# EAGLE design satcam_v3_mini (EAGLE 7.7.0)
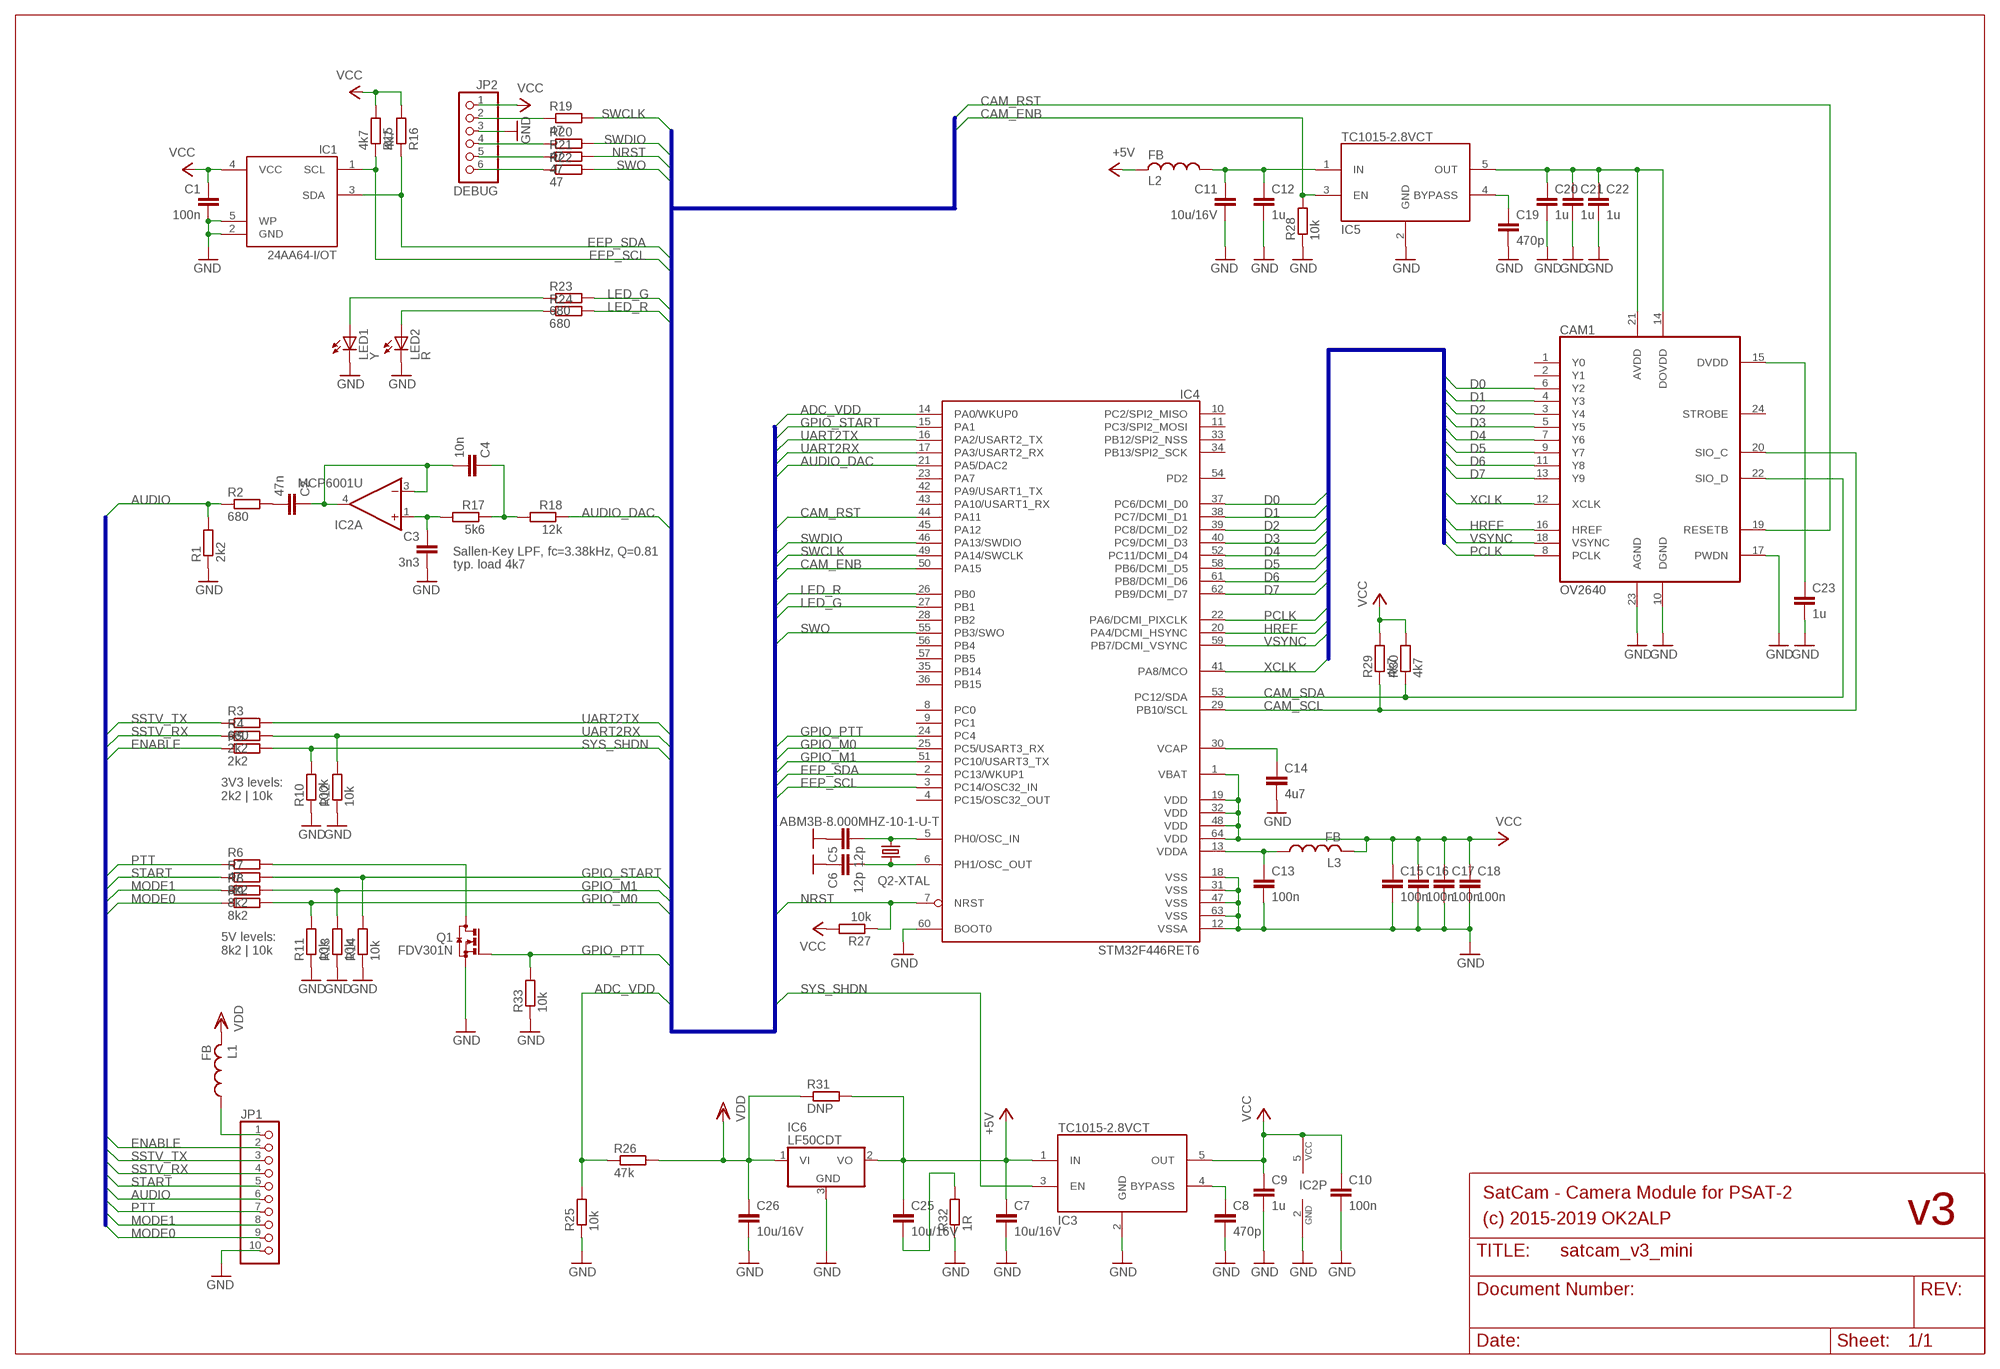
[diagram p0: schematic, sheet 1]

## Parts
C1  100n  C-EUC0603  [C0603]
C2  47n  C-EUC0603  [C0603]
C3  3n3  C-EUC0603  [C0603]
C4  10n  C-EUC0603  [C0603]
C5  12p  C-EUC0603  [C0603]
C6  12p  C-EUC0603  [C0603]
C7  10u/16V  C-EUC0805K  [C0805K]
C8  470p  C-EUC0603  [C0603]
C9  1u  C-EUC0603  [C0603]
C10  100n  C-EUC0603  [C0603]
C11  10u/16V  C-EUC0805K  [C0805K]
C12  1u  C-EUC0603  [C0603]
C13  100n  C-EUC0603  [C0603]
C14  4u7  C-EUC0603  [C0603]
C15  100n  C-EUC0603  [C0603]
C16  100n  C-EUC0603  [C0603]
C17  100n  C-EUC0603  [C0603]
C18  100n  C-EUC0603  [C0603]
C19  470p  C-EUC0603  [C0603]
C20  1u  C-EUC0603  [C0603]
C21  1u  C-EUC0402  [C0402]
C22  1u  C-EUC0402  [C0402]
C23  1u  C-EUC0402  [C0402]
C25  10u/16V  C-EUC0805K  [C0805K]
C26  10u/16V  C-EUC0805K  [C0805K]
CAM1  OV2640  [52745-2490]
IC1  24AA64-I/OT  [SOT23-5]
IC2  MCP6001U  [SOT23-5]
IC3  TC1015-2.8VCT  TC1015  [SOT23-5]
IC4  STM32F446RET6  [TQFP64-10X10]
IC5  TC1015-2.8VCT  TC1015  [SOT23-5]
IC6  LF50CDT  7805DT  [TO252]
JP1  PINHD-1X10  [1X10]
JP2  DEBUG  PINHD-1X6  [1X06]
L1  FB  [R0603]
L2  FB  [R0603]
L3  FB  [R0603]
LED1  Y  LEDCHIP-LED0603  [CHIP-LED0603]
LED2  R  LEDCHIP-LED0603  [CHIP-LED0603]
Q1  FDV301N  BSS123  [SOT23]
Q2  ABM3B-8.000MHZ-10-1-U-T  C3E_CRYSTAL-5032  [CER5032]
R1  2k2  R-EU_R0603  [R0603]
R2  680  R-EU_R0603  [R0603]
R3  680  R-EU_R0603  [R0603]
R4  2k2  R-EU_R0603  [R0603]
R5  2k2  R-EU_R0603  [R0603]
R6  47  R-EU_R0603  [R0603]
R7  8k2  R-EU_R0603  [R0603]
R8  8k2  R-EU_R0603  [R0603]
R9  8k2  R-EU_R0603  [R0603]
R10  100k  R-EU_R0603  [R0603]
R11  10k  R-EU_R0603  [R0603]
R12  10k  R-EU_R0603  [R0603]
R13  10k  R-EU_R0603  [R0603]
R14  10k  R-EU_R0603  [R0603]
R15  4k7  R-EU_R0603  [R0603]
R16  4k7  R-EU_R0603  [R0603]
R17  5k6  R-EU_R0603  [R0603]
R18  12k  R-EU_R0603  [R0603]
R19  47  R-EU_R0603  [R0603]
R20  47  R-EU_R0603  [R0603]
R21  47  R-EU_R0603  [R0603]
R22  47  R-EU_R0603  [R0603]
R23  680  R-EU_R0603  [R0603]
R24  680  R-EU_R0603  [R0603]
R25  10k  R-EU_R0603  [R0603]
R26  47k  R-EU_R0603  [R0603]
R27  10k  R-EU_R0603  [R0603]
R28  10k  R-EU_R0603  [R0603]
R29  4k7  R-EU_R0603  [R0603]
R30  4k7  R-EU_R0603  [R0603]
R31  DNP  R-EU_R0603  [R0603]
R32  1R  R-EU_R0603  [R0603]
R33  10k  R-EU_R0603  [R0603]

## Nets
+5V: C7.1 C25.1 IC3.1(IN) IC6.2(VO) L2.2 R31.2
ADC_VDD: IC4.14(PA0/WKUP0) R25.2 R26.1
AUDIO: JP1.6 R1.2 R2.1
AUDIO_DAC: IC4.21(PA5/DAC2) R18.1
CAM_ENB: IC4.50(PA15) IC5.3(EN) R28.2
CAM_RST: CAM1.19(RESETB) IC4.44(PA11)
CAM_SCL: CAM1.20(SIO_C) IC4.29(PB10/SCL) R29.1
CAM_SDA: CAM1.22(SIO_D) IC4.53(PC12/SDA) R30.1
D0: CAM1.6(Y2) IC4.37(PC6/DCMI_D0)
D1: CAM1.4(Y3) IC4.38(PC7/DCMI_D1)
D2: CAM1.3(Y4) IC4.39(PC8/DCMI_D2)
D3: CAM1.5(Y5) IC4.40(PC9/DCMI_D3)
D4: CAM1.7(Y6) IC4.52(PC11/DCMI_D4)
D5: CAM1.9(Y7) IC4.58(PB6/DCMI_D5)
D6: CAM1.11(Y8) IC4.61(PB8/DCMI_D6)
D7: CAM1.13(Y9) IC4.62(PB9/DCMI_D7)
EEP_SCL: IC1.1(SCL) IC4.3(PC14/OSC32_IN) R15.1
EEP_SDA: IC1.3(SDA) IC4.2(PC13/WKUP1) R16.1
ENABLE: JP1.2 R5.1
GND: C1.2 C3.2 C5.1 C6.1 C7.2 C8.2 C9.2 C10.2 C11.2 C12.2 C13.2 C14.2 C15.2 C16.2 C17.2 C18.2 C19.2 C20.2 C21.2 C22.2 C23.2 C26.2 CAM1.10(DGND) CAM1.17(PWDN) CAM1.23(AGND) IC1.2(GND) IC1.5(WP) IC2.2(P:GND) IC3.2(GND) IC4.12(VSSA) IC4.18(VSS) IC4.31(VSS) IC4.47(VSS) IC4.60(BOOT0) IC4.63(VSS) IC5.2(GND) IC6.3(GND) JP1.10 JP2.3 LED1.C LED2.C Q1.2(S) Q2.2(-GND1:GND) Q2.4(-GND2:GND) R1.1 R10.1 R11.1 R12.1 R13.1 R14.1 R25.1 R28.1 R32.1 R33.1
GPIO_M0: IC4.25(PC5/USART3_RX) R9.2 R11.2
GPIO_M1: IC4.51(PC10/USART3_TX) R8.2 R13.2
GPIO_PTT: IC4.24(PC4) Q1.1(G) R33.2
GPIO_START: IC4.15(PA1) R7.2 R14.2
HREF: CAM1.16(HREF) IC4.20(PA4/DCMI_HSYNC)
LED_G: IC4.27(PB1) R23.2
LED_R: IC4.26(PB0) R24.2
MODE0: JP1.9 R9.1
MODE1: JP1.8 R8.1
N$1: C11.1 C12.1 IC5.1(IN) L2.1
N$2: C23.1 CAM1.15(DVDD)
N$3: Q1.3(D) R6.2
N$4: C19.1 IC5.4(BYPASS)
N$6: C25.2 R32.2
N$7: JP1.1 L1.1
N$9: C8.1 IC3.4(BYPASS)
N$10: LED2.A R24.1
N$11: LED1.A R23.1
N$12: C14.1 IC4.30(VCAP)
N$18: C13.1 IC4.13(VDDA) L3.1
N$26: C6.2 IC4.6(PH1/OSC_OUT) Q2.3
N$27: C5.2 IC4.5(PH0/OSC_IN) Q2.1
N$129: C2.1 C4.2 IC2.3(A:-IN) IC2.4(A:OUT)
N$130: C4.1 R17.1 R18.2
N$131: C3.1 IC2.1(A:+IN) R17.2
N$137: JP2.4 R20.1
N$138: JP2.2 R19.1
N$143: JP2.5 R21.1
N$145: JP2.6 R22.1
N$152: C2.2 R2.2
NRST: IC4.7(NRST) R21.2 R27.1
PCLK: CAM1.8(PCLK) IC4.22(PA6/DCMI_PIXCLK)
PTT: JP1.7 R6.1
SSTV_RX: JP1.4 R4.1
SSTV_TX: JP1.3 R3.1
START: JP1.5 R7.1
SWCLK: IC4.49(PA14/SWCLK) R19.2
SWDIO: IC4.46(PA13/SWDIO) R20.2
SWO: IC4.55(PB3/SWO) R22.2
SYS_SHDN: IC3.3(EN) R5.2 R10.2
UART2RX: IC4.17(PA3/USART2_RX) R4.2 R12.2
UART2TX: IC4.16(PA2/USART2_TX) R3.2
VCAM: C20.1 C21.1 C22.1 CAM1.14(DOVDD) CAM1.21(AVDD) IC5.5(OUT)
VCC: C1.1 C9.1 C10.1 C15.1 C16.1 C17.1 C18.1 IC1.4(VCC) IC2.5(P:VCC) IC3.5(OUT) IC4.1(VBAT) IC4.19(VDD) IC4.32(VDD) IC4.48(VDD) IC4.64(VDD) JP2.1 L3.2 R15.2 R16.2 R27.2 R29.2 R30.2
VDD: C26.1 IC6.1(VI) L1.2 R26.2 R31.1
VSYNC: CAM1.18(VSYNC) IC4.59(PB7/DCMI_VSYNC)
XCLK: CAM1.12(XCLK) IC4.41(PA8/MCO)
Unconnected: CAM1.1(Y0) CAM1.2(Y1) CAM1.24(STROBE) IC4.4(PC15/OSC32_OUT) IC4.8(PC0) IC4.9(PC1) IC4.10(PC2/SPI2_MISO) IC4.11(PC3/SPI2_MOSI) IC4.23(PA7) IC4.28(PB2) IC4.33(PB12/SPI2_NSS) IC4.34(PB13/SPI2_SCK) IC4.35(PB14) IC4.36(PB15) IC4.42(PA9/USART1_TX) IC4.43(PA10/USART1_RX) IC4.45(PA12) IC4.54(PD2) IC4.56(PB4) IC4.57(PB5)

## Buses
D[0..7],PCLK,XCLK,HREF,VSYNC
GPIO_START,GPIO_PTT,GPIO_M0,GPIO_M1,ADC_VDD,AUDIO_DAC,UART2TX,UART2RX,CAM_RST,CAM_ENB,SWDIO,SWCLK,SWO,NRST,LED_R,LED_G,SYS_SHDN,EEP_SDA,EEP_SCL
SSTV_RX,SSTV_TX,ENABLE,START,AUDIO,PTT,MODE0,MODE1

## Notes on the sheet
- Sallen-Key LPF, fc=3.38kHz, Q=0.81
- typ. load 4k7
- 3V3 levels:
  2k2 | 10k
- 5V levels:
  8k2 | 10k
- SatCam - Camera Module for PSAT-2
- (c) 2015-2019 OK2ALP | v3

## Library data of the parts
C1-C23 C25 C26 = rcl:C-EU: CAPACITOR, European symbol
CAM1 = satcam:OV2640
IC1 = satcam:24AA64
IC2 = satcam:MCP6001U
IC3 IC5 = satcam:TC1015
IC4 = satcam:STM32F446RET6
IC6 = linear:78*: Positive VOLTAGE REGULATOR Source: http://cache.national.com/ds/LM/LM78L05.pdf http://www.fairchildsemi.com/ds/LM/LM7805.pdf
JP1 = pinhead:PINHD-1X10: PIN HEADER
JP2 = pinhead:PINHD-1X6: PIN HEADER
L1-L3 = satcam:FB
LED1 LED2 = led:LED: LED OSRAM: - CHIPLED LG R971, LG N971, LY N971, LG Q971, LY Q971, LO R971, LY R971 LH N974, LH R974 LS Q976, LO Q976, LY Q976 LO Q996 - Hyper CHIPLED LW Q18S LB Q993, LB Q99A, LB R99A - SideLED LS A670, LO A670, LY A670, LG A670, LP A670 LB A673, LV A673, LT A673, LW A673 LH A674 LY A675 LS A676, LA A676, LO A676, LY A676, LW A676 LS A679, LY A679, LG A679 - Hyper Micro SIDELED® LS Y876, LA Y876, LO Y876, LY Y876 LT Y87S - SmartLED LW L88C, LW L88S LB L89C, LB L89S, LG L890 LS L89K, LO L89K, LY L89K LS L896, LA L896, LO L896, LY L896 - TOPLED LS T670, LO T670, LY T670, LG T670, LP T670 LSG T670, LSP T670, LSY T670, LOP T670, LYG T670 LG T671, LOG T671, LSG T671 LB T673, LV T673, LT T673, LW T673 LH T674 LS T676, LA T676, LO T676, LY T676, LB T676, LH T676, LSB T676, LW T676 LB T67C, LV T67C, LT T67C, LS T67K, LO T67K, LY T67K, LW E67C LS E67B, LA E67B, LO E67B, LY E67B, LB E67C, LV E67C, LT E67C LW T67C LS T679, LY T679, LG T679 LS T770, LO T770, LY T770, LG T770, LP T770 LB T773, LV T773, LT T773, LW T773 LH T774 LS E675, LA E675, LY E675, LS T675 LS T776, LA T776, LO T776, LY T776, LB T776 LHGB T686 LT T68C, LB T68C - Hyper Mini TOPLED® LB M676 - Mini TOPLED Santana® LG M470 LS M47K, LO M47K, LY M47K Source: http://www.osram.convergy.de LUXEON: - LUMILED® LXK2-PW12-R00, LXK2-PW12-S00, LXK2-PW14-U00, LXK2-PW14-V00 LXK2-PM12-R00, LXK2-PM12-S00, LXK2-PM14-U00 LXK2-PE12-Q00, LXK2-PE12-R00, LXK2-PE12-S00, LXK2-PE14-T00, LXK2-PE14-U00 LXK2-PB12-K00, LXK2-PB12-L00, LXK2-PB12-M00, LXK2-PB14-N00, LXK2-PB14-P00, LXK2-PB14-Q00 LXK2-PR12-L00, LXK2-PR12-M00, LXK2-PR14-Q00, LXK2-PR14-R00 LXK2-PD12-Q00, LXK2-PD12-R00, LXK2-PD12-S00 LXK2-PH12-R00, LXK2-PH12-S00 LXK2-PL12-P00, LXK2-PL12-Q00, LXK2-PL12-R00 Source: www.luxeon.com KINGBRIGHT: KA-3528ASYC Source: www.kingbright.com
Q1 = transistor-small-signal:BSS123: N-CHANNEL MOS FET
Q2 = satcam:C3E_CRYSTAL
R1-R33 = rcl:R-EU_: RESISTOR, European symbol

## Board
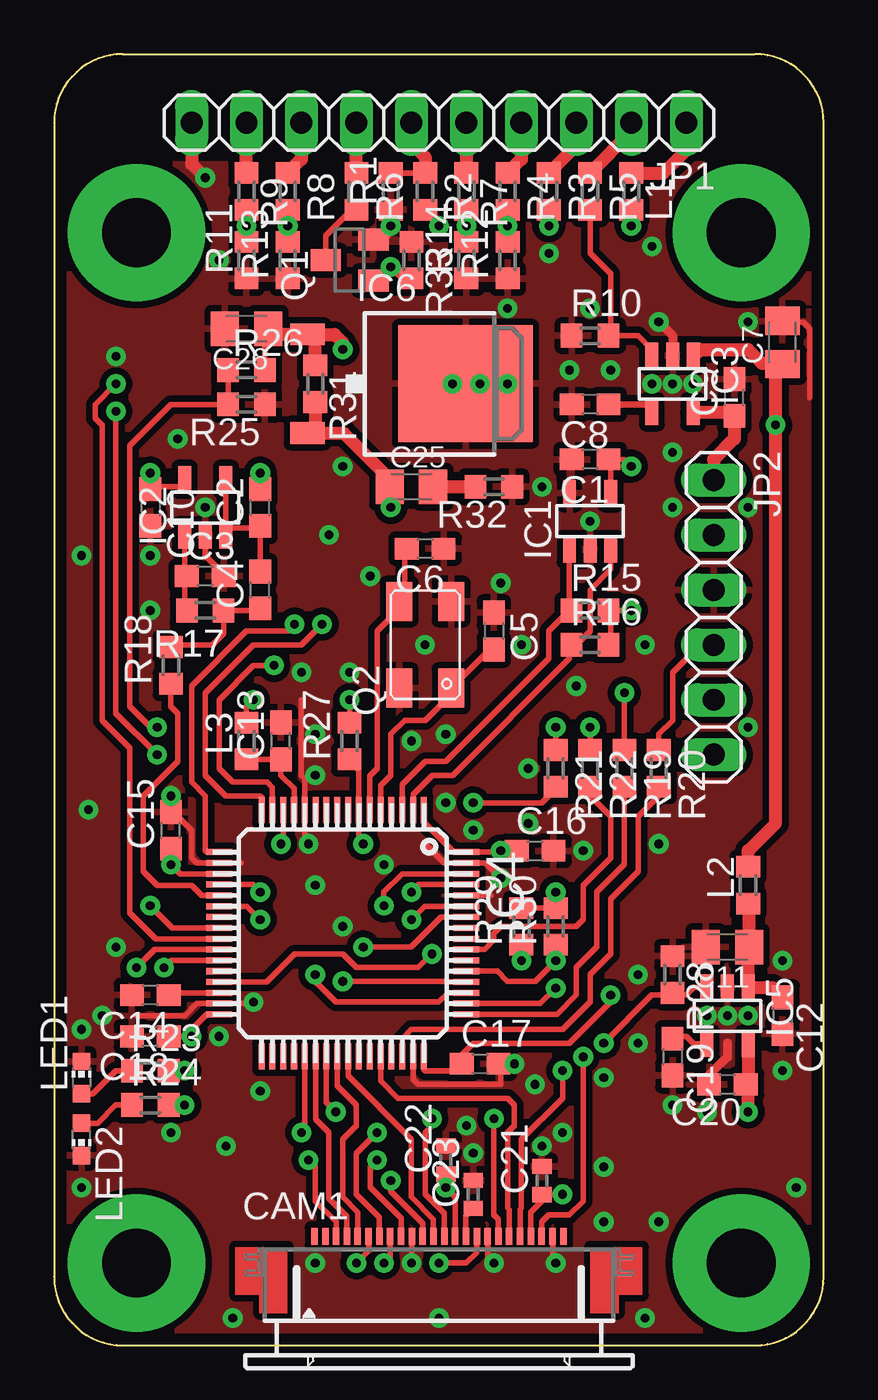
[diagram p1: board, top side]
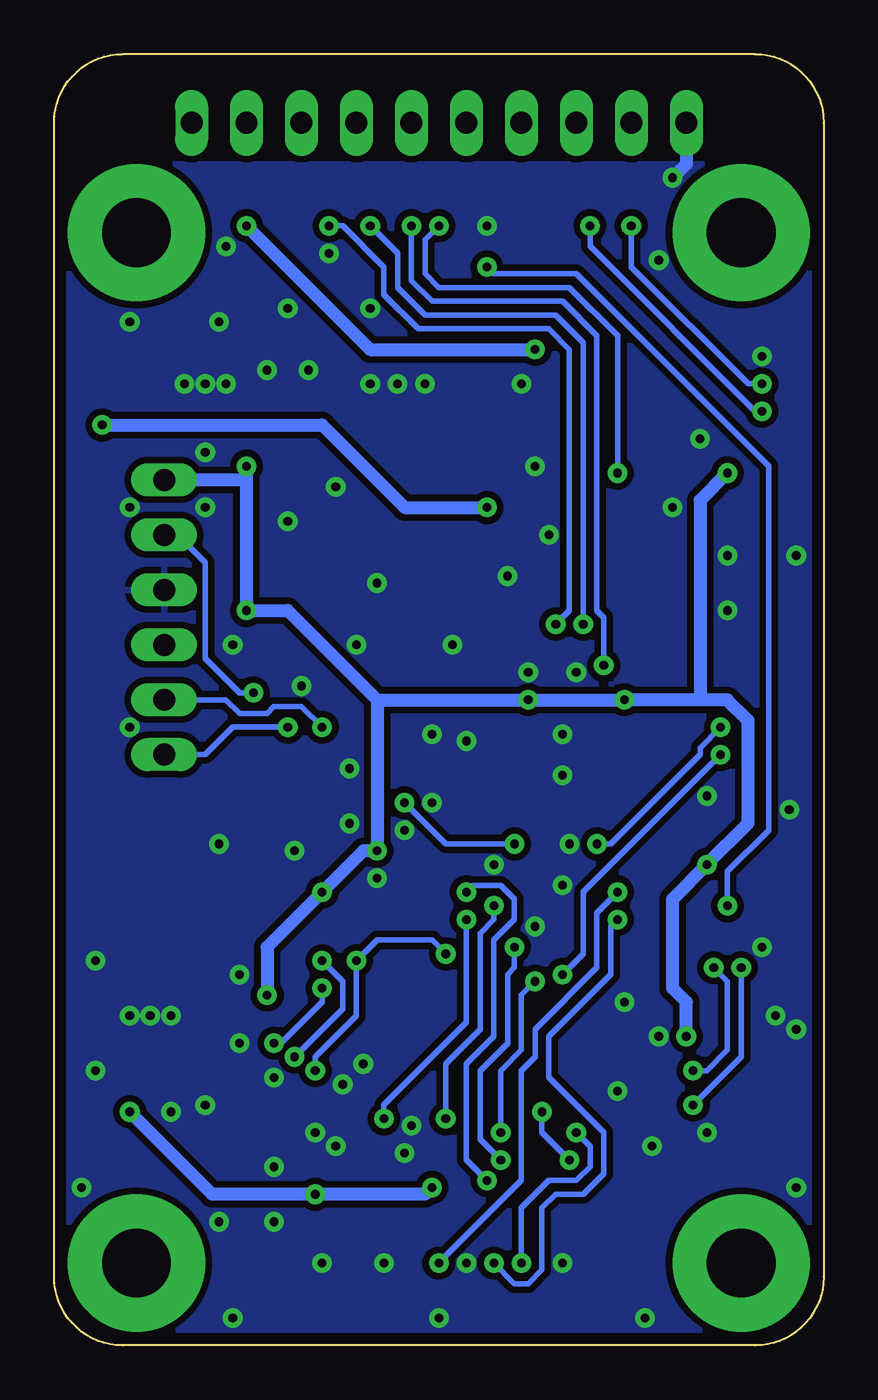
[diagram p2: board, bottom side, seen from below]

Size 35.56 x 59.69 mm. Coordinates in mm from the lower left corner, seen from the top.
Outline: 3.17,0 32.38,0 arc90 35.56,3.17 35.56,56.52 arc90 32.38,59.69 3.17,59.69 arc90 0,56.52 0,3.17 arc90 3.17,0
Copper layers (1*16): Top 0.035mm / dielectric 1.5mm / Bottom 0.035mm
Design rules "default *": minimum track width 10mil, minimum drill 0.4mm, track to track 8mil, track to pad 8mil, pad to pad 8mil, via to via 8mil, smd to smd 0mil, copper to edge 20mil, drill to drill 8mil, minimum pad ring 8mil, minimum via ring 10mil, stop-mask expansion 2mil, vias tented up to drill 0.4mm, thermal gap 12mil

### Footprints (pad centres in the part's own frame; a part is rotated, then mirrored left to right if it is on the bottom)
C0603 = smd 1.1 x 1: 1 -0.85,0; 2 0.85,0
C0805K = smd 1.3 x 1.6: 1 -1,0; 2 1,0
C0402 = smd 0.7 x 0.9: 1 -0.65,0; 2 0.65,0
52745-2490 = smd 0.3 x 0.8: 1 -5.75,2.5; 2 -5.25,2.5; 3 -4.75,2.5; 4 -4.25,2.5; 5 -3.75,2.5; 6 -3.25,2.5; 7 -2.75,2.5; 8 -2.25,2.5; 9 -1.75,2.5; 10 -1.25,2.5; 11 -0.75,2.5; 12 -0.25,2.5; 13 0.25,2.5; 14 0.75,2.5; 15 1.25,2.5; 16 1.75,2.5; 17 2.25,2.5; 18 2.75,2.5; 19 3.25,2.5; 20 3.75,2.5; 21 4.25,2.5; 22 4.75,2.5; 23 5.25,2.5; 24 5.75,2.5
SOT23-5 = smd 0.6 x 1.2: 1 -0.95,-1.306; 2 0,-1.306; 3 0.95,-1.306; 4 0.95,1.306; 5 -0.95,1.306
TQFP64-10X10 = smd 1.2 x 0.28: 1 -5.7,3.75; 2 -5.7,3.25; 3 -5.7,2.75; 4 -5.7,2.25; 5 -5.7,1.75; 6 -5.7,1.25; 7 -5.7,0.75; 8 -5.7,0.25; 9 -5.7,-0.25; 10 -5.7,-0.75; 11 -5.7,-1.25; 12 -5.7,-1.75; 13 -5.7,-2.25; 14 -5.7,-2.75; 15 -5.7,-3.25; 16 -5.7,-3.75; 33 5.7,-3.75; 34 5.7,-3.25; 35 5.7,-2.75; 36 5.7,-2.25; 37 5.7,-1.75; 38 5.7,-1.25; 39 5.7,-0.75; 40 5.7,-0.25; 41 5.7,0.25; 42 5.7,0.75; 43 5.7,1.25; 44 5.7,1.75; 45 5.7,2.25; 46 5.7,2.75; 47 5.7,3.25; 48 5.7,3.75 | smd 0.28 x 1.2: 17 -3.75,-5.7; 18 -3.25,-5.7; 19 -2.75,-5.7; 20 -2.25,-5.7; 21 -1.75,-5.7; 22 -1.25,-5.7; 23 -0.75,-5.7; 24 -0.25,-5.7; 25 0.25,-5.7; 26 0.75,-5.7; 27 1.25,-5.7; 28 1.75,-5.7; 29 2.25,-5.7; 30 2.75,-5.7; 31 3.25,-5.7; 32 3.75,-5.7; 49 3.75,5.7; 50 3.25,5.7; 51 2.75,5.7; 52 2.25,5.7; 53 1.75,5.7; 54 1.25,5.7; 55 0.75,5.7; 56 0.25,5.7; 57 -0.25,5.7; 58 -0.75,5.7; 59 -1.25,5.7; 60 -1.75,5.7; 61 -2.25,5.7; 62 -2.75,5.7; 63 -3.25,5.7; 64 -3.75,5.7
TO252 = smd 1 x 1.6: 1 -2.28,-4.8; 2 2.28,-4.8 | smd 5.4 x 6.2: 3 0,2.5
1X10 = drill 1.016 long: 1 -11.43,0; 2 -8.89,0; 3 -6.35,0; 4 -3.81,0; 5 -1.27,0; 6 1.27,0; 7 3.81,0; 8 6.35,0; 9 8.89,0; 10 11.43,0
1X06 = drill 1.016 long: 1 -6.35,0; 2 -3.81,0; 3 -1.27,0; 4 1.27,0; 5 3.81,0; 6 6.35,0
R0603 = smd 1 x 1.1: 1 -0.85,0; 2 0.85,0
CHIP-LED0603 = smd 0.8 x 0.8: A 0,-0.75; C 0,0.75
SOT23 = smd 1 x 1.4: 1 -0.95,-1.1; 2 0.95,-1.1; 3 0,1.1
CER5032 = smd 1.8 x 1.2: 1 -2,-1.2; 2 2,-1.2; 3 2,1.2; 4 -2,1.2

### Placement (x,y rotation side)
C1  24.77,40.96 180 top
C2  9.53,38.73 90 top
C3  6.99,35.56 0 top
C4  9.53,34.92 90 top
C5  20.32,33.02 270 top
C6  17.14,36.83 180 top
C7  33.66,46.35 90 top
C8  24.77,43.5 180 top
C9  31.43,43.81 90 top
C10  4.45,38.73 270 top
C11  31.11,18.41 180 top
C12  33.66,15.24 270 top
C13  10.48,27.94 90 top
C14  4.45,16.19 180 top
C15  5.4,23.81 90 top
C16  22.23,22.86 0 top
C17  19.68,13.02 0 top
C18  4.45,14.29 180 top
C19  28.57,13.34 270 top
C20  31.11,12.06 180 top
C21  22.54,7.62 90 top
C22  18.1,8.57 90 top
C23  19.37,6.99 90 top
C25  16.51,39.69 0 top
C26  8.89,46.99 180 top
CAM1  17.78,2.54 0 top
IC1  24.77,38.1 0 top
IC2  6.99,38.73 0 top
IC3  28.57,44.45 180 top
IC4  13.34,19.05 270 top
IC5  31.11,15.24 180 top
IC6  16.51,44.45 270 top
JP1  17.78,56.52 180 top
JP2  30.48,33.66 270 top
L1  26.67,53.34 270 top
L2  32.07,21.27 90 top
L3  8.89,27.94 90 top
LED1  1.27,12.38 0 top
LED2  1.27,9.53 180 top
Q1  13.65,50.16 90 top
Q2  17.14,32.38 90 top
R1  15.56,53.34 90 top
R2  17.14,53.34 270 top
R3  22.86,53.34 270 top
R4  20.95,53.34 270 top
R5  24.77,53.34 270 top
R6  13.97,53.34 270 top
R7  19.05,53.34 270 top
R8  10.79,53.34 270 top
R9  8.89,53.34 270 top
R10  24.77,46.67 0 top
R11  8.89,50.16 90 top
R12  20.95,50.16 90 top
R13  10.79,50.16 90 top
R14  19.05,50.16 90 top
R15  24.77,33.97 0 top
R16  24.77,32.38 0 top
R17  6.99,33.97 180 top
R18  5.4,31.43 90 top
R19  26.35,26.67 270 top
R20  27.94,26.67 270 top
R21  23.18,26.67 270 top
R22  24.77,26.67 270 top
R23  4.45,12.7 0 top
R24  4.45,11.11 0 top
R25  8.89,43.5 180 top
R26  8.89,45.09 0 top
R27  13.65,27.94 90 top
R28  28.57,17.14 270 top
R29  21.59,19.37 90 top
R30  23.18,19.37 90 top
R31  12.06,44.45 270 top
R32  20.32,39.69 180 top
R33  16.51,50.16 270 top

### Tracks (layer width: path | path; a pad name or v marks a point on that pad's centre or on a via)
+5V  (via drill 0.4)
  Top 0.61: L2.2 32.07,22.86 33.34,24.13 v33.34,42.55 33.34,45.04 C7.1 33.61,45.4 32.7,45.4 32.07,46.04 29.84,46.04 29.56,45.76 IC3.1 | R31.2 12.06,42.52 IC6.2 13.39,42.17 15.51,40.05 C25.1 15.56,39.64 v15.56,38.73
  Bottom 0.61: v33.34,42.55 23.18,42.55 19.37,38.73 v15.56,38.73
ADC_VDD  (via drill 0.4)
  Top 0.254: IC4.14 10.59,23.29 v10.48,23.18 | v4.76,28.57 4.45,28.57 3.49,29.53 3.49,41.59 5.4,43.5 R25.2 R26.1
  Bottom 0.254: v10.48,23.18 9.84,23.18 5.71,27.3 5.71,27.62 v4.76,28.57
AUDIO
  Top 0.254: R1.2 R2.1
  Top 0.61: JP1.6 16.51,55.56 17.14,54.93 R2.1
AUDIO_DAC
  Top 0.254: IC4.21 6.82,20.8 6.35,21.27 4.76,21.27 4.13,21.91 4.13,25.4 5.71,26.99 5.71,29.21 5.4,29.53 R18.1
CAM_ENB  (via drill 0.4)
  Top 0.254: IC5.3 29.56,16.55 29.21,16.19 28.68,16.19 R28.2 28.57,16.19 27.62,16.19 v25.4,13.97 | IC4.50 22.47,15.8 v23.18,16.51
  Bottom 0.254: v23.18,16.51 23.18,15.88 25.08,13.97 v25.4,13.97
CAM_RST
  Top 0.254: IC4.44 15.09,12.22 15.88,11.43 20.95,11.43 21.27,11.11 21.27,10.16 20.95,9.84 20.95,6.35 21.03,6.28 CAM1.19
CAM_SCL  (via drill 0.4)
  Top 0.254: IC4.29 9.81,16.8 11.11,18.1 13.34,18.1 13.97,17.46 16.83,17.46 v17.46,18.1 | CAM1.20 21.53,6.29 21.59,6.35 21.59,9.53 23.5,11.43 v23.5,12.7 | R29.1 v21.59,17.78
  Bottom 0.254: v17.46,18.1 18.1,18.73 20.64,18.73 v21.59,17.78 21.59,15.24 23.5,13.34 v23.5,12.7
CAM_SDA  (via drill 0.4)
  Top 0.254: IC4.53 20.48,17.3 20.95,16.83 22.23,16.83 v23.18,17.78 R30.1 | CAM1.22 22.53,5.7 22.86,6.03 23.81,6.03 24.45,6.67 v24.45,13.34
  Bottom 0.254: v23.18,17.78 22.23,16.83 22.23,15.56 v24.45,13.34
D0  (via drill 0.4)
  Top 0.254: CAM1.6 14.53,4.37 v13.97,3.81 | IC4.37 11.59,10 v11.43,9.84
  Bottom 0.254: v13.97,3.81 13.97,6.35 12.7,7.62 11.43,7.62 10.79,8.26 10.79,9.21 v11.43,9.84
D1
  Top 0.254: IC4.38 12.09,10.46 12.7,9.84 12.7,6.79 13.53,5.96 CAM1.4
D2  (via drill 0.4)
  Top 0.254: IC4.39 12.59,11.23 v13.02,10.79 | CAM1.3 13.03,5.7 12.06,6.67 12.06,8.26 v11.75,8.57
  Bottom 0.254: v11.75,8.57 13.02,9.84 v13.02,10.79
D3
  Top 0.254: IC4.40 13.09,12 13.97,11.11 13.97,10.16 13.34,9.53 13.34,6.86 14.03,6.16 CAM1.5
D4  (via drill 0.4)
  Top 0.254: IC4.52 18.12,16.8 18.1,16.83 v13.34,16.83 | CAM1.7 15.03,5.92 13.97,6.99 13.97,8.89 v14.92,9.84
  Bottom 0.254: v13.34,16.83 13.97,16.19 13.97,13.65 14.92,12.7 v14.92,9.84
D5  (via drill 0.4)
  Top 0.254: IC4.58 17.89,19.8 16.51,18.41 v14.29,18.41 | CAM1.9 16.03,5.88 14.61,7.3 14.61,8.26 v14.92,8.57
  Bottom 0.254: v14.29,18.41 14.29,17.46 14.61,17.14 14.61,13.97 15.88,12.7 15.88,9.53 v14.92,8.57
D6  (via drill 0.4)
  Top 0.254: IC4.61 16.86,21.3 v16.51,20.95 | CAM1.11 17.03,5.64 15.56,7.11 v15.56,7.62
  Bottom 0.254: v15.56,7.62 16.51,8.57 16.51,13.02 15.24,14.29 15.24,18.73 14.29,19.68 14.29,20.64 14.92,21.27 16.19,21.27 v16.51,20.95
D7  (via drill 0.4)
  Top 0.254: IC4.62 16.09,21.8 15.24,20.95 v15.24,20.32 | CAM1.13 18.03,6.1 17.14,6.99 17.14,9.84 17.46,10.16 v17.46,10.48
  Bottom 0.254: v15.24,20.32 15.24,19.68 15.88,19.05 15.88,14.61 17.46,13.02 v17.46,10.48
EEP_SCL
  Top 0.254: IC4.3 16.09,25.93 17.14,26.99 18.1,26.99 22.86,31.75 22.86,33.02 23.81,33.97 | IC1.1 23.82,36.83 23.81,36.83 23.81,33.97 | 23.81,33.97 R15.1
EEP_SDA
  Top 0.254: IC4.2 16.59,25.48 17.46,26.35 18.41,26.35 23.81,31.75 23.81,32.38 R16.1 24.13,32.38 24.77,33.02 24.77,34.92 25.72,35.88 25.72,36.83 25.71,36.83 IC1.3
ENABLE
  Top 0.61: JP1.2 26.67,56.09 R5.1
GND  (via drill 0.4)
  Top 0.254: C3.2 7.94,35.56 6.99,36.51 IC2.2 | 3.81,15.24 6.03,15.24 6.59,15.8 IC4.31 8.81,15.8 | 20.32,21.91 19.93,22.3 IC4.63 18.02,22.3 17.14,23.18 | 11.59,23.65 IC4.12 11.59,26.2 11.43,26.35 11.43,29.84 | IC4.60 20.16,20.8 | IC4.47 16.59,12.31 16.83,12.06 20.64,12.06 20.64,13.02 C17.2 | C15.2 5.4,24.77 6.35,23.81 6.35,22.54 6.59,22.3 IC4.18 8.65,22.3 | 16.53,4.09 CAM1.10 | 20.03,3.77 CAM1.17 | 23.03,4.09 CAM1.23 | 34.92,43.81 34.92,46.99 34.61,47.31 33.97,47.31 | v15.56,51.75 15.56,51.44 15.24,51.12 Q1.2
  Top 0.406: 28.57,45.72 28.57,46.67 v27.94,47.31 | 31.11,13.97 31.11,13.34 30.16,12.38 30.16,12.06
  Top 0.61: JP1.10 6.35,54.61 v6.99,53.98
  Bottom 0.61: JP1.10 6.35,54.61 v6.99,53.98
  other vias: 21.27,13.02 20.64,21.59 28.57,44.45 27.62,44.45 29.53,44.45 5.4,25.4 7.94,9.21 9.53,11.75 9.21,15.88 2.86,18.41 21.91,26.67 19.37,23.81 24.45,22.86 27.94,23.18 21.59,32.38 22.54,39.69 13.65,31.11 28.57,41.27 32.07,47.31 6.99,38.73 4.45,36.51 32.07,38.73 18.1,25.08 24.77,38.1 15.24,22.23 13.34,19.37 20.64,35.24 11.75,23.18 16.51,27.94 21.91,24.13 24.77,47.94 25.72,45.09 23.81,45.09 27.3,32.38 28.57,38.73 17.14,32.38 7.62,14.29 32.07,28.57 1.27,36.51 14.61,35.56 18.1,28.26 5.4,9.84 2.22,15.24 31.11,15.24 22.54,9.21 23.5,9.84 19.05,10.16 19.37,8.89 20.32,3.81 23.18,3.81 16.51,3.81 22.23,12.06 28.57,11.11 30.16,10.79 12.06,28.26 12.06,26.35 12.06,3.81 4.45,33.97 26.99,17.14 26.99,13.97 25.4,8.26 25.4,12.38 25.4,5.71 27.94,5.71 34.29,7.3 12.06,21.27 8.26,1.27 27.3,1.27 33.66,12.7 33.66,17.78 24.13,30.48 1.27,7.3 1.27,14.61 1.59,24.77 2.86,45.72 7.62,50.16 22.86,50.48 20.95,47.94 20.95,44.45 19.68,44.45 18.41,44.45 13.97,44.45 13.34,40.64 11.43,31.11 5.71,41.91 27.62,50.8 12.7,37.47 17.78,1.27 30.16,15.24 32.07,15.24
  pour Top (isolate 0.305): 0,0 35.56,0 35.56,54.61 0,54.61
  pour Bottom (isolate 0.305): 0,0 35.56,0 35.56,54.61 0,54.61
GPIO_M0  (via drill 0.4)
  Top 0.254: IC4.25 4.7,18.8 3.49,20 3.49,27.62 2.22,28.89 2.22,42.55 1.91,42.86 1.91,43.5 v2.86,44.45 | R9.2 v8.89,51.75 R11.2
  Bottom 0.254: v8.89,51.75 8.89,49.85 3.49,44.45 v2.86,44.45
GPIO_M1  (via drill 0.4)
  Top 0.254: IC4.51 18.2,16.3 17.78,15.88 13.02,15.88 12.06,16.83 v12.06,17.14 | v4.76,27.3 2.86,29.21 v2.86,43.18 | R8.2 v10.79,51.75 R13.2
  Bottom 0.254: v12.06,17.14 11.11,18.1 11.11,20.95 v4.76,27.3 | v10.79,51.75 10.79,50.8 3.17,43.18 v2.86,43.18
GPIO_PTT  (via drill 0.4)
  Top 0.254: IC4.24 5.46,19.3 v4.45,20.32 | Q1.1 14.93,49.22 v15.56,49.85 16.09,49.31 R33.2
  Bottom 0.254: v4.45,20.32 4.45,21.91 2.54,23.81 2.54,40.64 11.43,49.53 15.24,49.53 v15.56,49.85
GPIO_START  (via drill 0.4)
  Top 0.254: IC4.15 10.09,25.79 9.84,26.04 8.26,26.04 7.62,26.67 7.62,29.84 9.21,31.43 v10.16,31.43 | R7.2 v19.05,51.75 R14.2
  Bottom 0.254: v19.05,51.75 19.05,49.21 18.1,48.26 12.06,48.26 10.48,46.67 10.48,33.97 10.16,33.66 v10.16,31.43
HREF  (via drill 0.4)
  Top 0.254: IC4.20 9.18,21.3 v9.53,20.95 | CAM1.16 19.53,4.29 19.05,3.81 v17.78,3.81
  Bottom 0.254: v9.53,20.95 10.48,20 10.48,17.46 13.34,14.61 13.34,13.34 13.97,12.7 13.97,7.62 v17.78,3.81
LED_G  (via drill 0.4)
  Top 0.254: IC4.27 5.42,17.8 v5.08,17.46 | R23.2 v6.03,12.7
  Bottom 0.254: v5.08,17.46 4.45,16.83 4.45,13.65 5.4,12.7 v6.03,12.7
LED_R  (via drill 0.4)
  Top 0.254: IC4.26 4.65,18.3 v3.81,17.46 | R24.2 v6.03,11.11
  Bottom 0.254: v3.81,17.46 3.81,13.34 v6.03,11.11
MODE0
  Top 0.61: R9.1 JP1.9
MODE1
  Top 0.61: JP1.8 11.43,54.83 R8.1
N$1
  Top 0.61: C12.1 33.2,16.55 IC5.1 32.06,18.36 C11.1 32.12,20.38 L2.1
N$2
  Top 0.254: CAM1.15 19.03,6 C23.1
N$3
  Top 0.254: R6.2 13.76,52.49 12.55,51.29 Q1.3
N$4
  Top 0.254: IC5.4 29.56,13.93 29.21,14.29 28.68,14.29 C19.1
N$5  (via drill 3.17 pad 6.35)
  other vias: 3.81,3.81
N$6
  Top 0.61: C25.2 R32.2
N$7
  Top 0.61: JP1.1 29.21,55.24 28.16,54.19 L1.1
N$8  (via drill 3.17 pad 6.35)
  other vias: 3.81,51.44
N$9
  Top 0.305: IC3.4 27.62,43.5 C8.1
N$10
  Top 0.254: LED2.A 2.02,10.28 2.86,11.11 R24.1
N$11
  Top 0.254: LED1.A 1.79,11.63 2.86,12.7 R23.1
N$12
  Top 0.254: C14.1 5.4,16.19 5.5,16.3 IC4.30
N$13  (via drill 3.17 pad 6.35)
  other vias: 31.75,51.44
N$14  (via drill 3.17 pad 6.35)
  other vias: 31.75,3.81
N$18
  Top 0.254: IC4.13 11.09,25.75 10.48,26.35 C13.1 L3.1
N$26
  Top 0.254: IC4.6 14.59,26.33 14.92,26.67 14.92,33.02 15.56,33.66 15.56,34 Q2.3 16.19,34.63 16.19,36.83 C6.2
N$27
  Top 0.254: IC4.5 15.09,25.88 15.56,26.35 15.56,28.26 16.19,28.89 17.14,28.89 18.1,29.84 18.1,30.14 Q2.1 20.13,32.17 C5.2
N$129
  Top 0.254: C4.2 9.53,37.78 | 9.53,37.78 C2.1 | 9.53,37.78 7.94,37.78 | 7.94,37.78 7.93,37.78 IC2.3 | IC2.4 7.93,37.78 7.94,37.78
N$130
  Top 0.254: C4.1 9.53,33.97 R17.1 7.83,32.92 7.3,32.38 5.5,32.38 R18.2
N$131
  Top 0.254: IC2.1 6.04,35.56 6.03,35.56 | R17.2 6.03,33.97 6.03,35.56 | 6.03,35.56 C3.1
N$137
  Top 0.254: JP2.4 29.84,32.38 28.57,31.11 28.57,28.89 27.94,28.26 R20.1
N$138  (via drill 0.4)
  Top 0.254: R19.1 v26.35,30.16
  Bottom 0.254: JP2.2 29.84,37.47 28.57,36.2 28.57,31.75 26.99,30.16 v26.35,30.16
N$143  (via drill 0.4)
  Top 0.254: R21.1 v23.18,28.57
  Bottom 0.254: v23.18,28.57 24.13,29.53 25.4,29.53 25.72,29.21 26.99,29.21 27.62,29.84 JP2.5
N$145  (via drill 0.4)
  Top 0.254: R22.1 v24.77,28.57
  Bottom 0.254: v24.77,28.57 27.3,28.57 28.57,27.3 JP2.6
N$152  (via drill 0.4)
  Top 0.254: C2.2 v9.53,40.32 | R2.2 17.14,52.39 v17.78,51.75
  Bottom 0.254: v17.78,51.75 18.41,51.12 18.41,49.53 17.78,48.9 11.75,48.9 9.53,46.67 v9.53,40.32
NRST  (via drill 0.4)
  Top 0.254: R27.1 13.65,26.99 14.09,26.55 IC4.7 14.09,23.38 v14.29,23.18 | R21.2 23.18,25.72 22.54,25.08 v19.37,25.08
  Bottom 0.254: v14.29,23.18 17.46,23.18 v19.37,25.08
PCLK  (via drill 0.4)
  Top 0.254: IC4.22 8.91,20.3 v9.53,19.68 | CAM1.8 15.53,4.1 v15.24,3.81
  Bottom 0.254: v9.53,19.68 9.84,19.37 9.84,17.14 12.7,14.29 12.7,12.38 10.16,9.84 10.16,7.94 11.11,6.99 12.38,6.99 13.02,6.35 13.02,3.49 13.65,2.86 14.29,2.86 v15.24,3.81
PTT
  Top 0.61: R6.1 JP1.7
SSTV_RX
  Top 0.61: JP1.4 21.59,54.83 R4.1
SSTV_TX
  Top 0.61: JP1.3 24.13,55.46 R3.1
START
  Top 0.61: JP1.5 R7.1
SWCLK
  Top 0.254: IC4.49 23.24,15.3 24.13,16.19 24.13,17.46 25.08,18.41 25.08,20.95 26.35,22.23 R19.2
SWDIO
  Top 0.254: IC4.46 16.09,14.18 16.51,14.61 23.5,14.61 24.77,15.88 24.77,17.14 25.72,18.1 25.72,20.64 26.99,21.91 26.99,24.45 27.94,25.4 R20.2
SWO
  Top 0.254: 24.77,25.72 R22.2 24.77,25.4 25.72,24.45 25.72,22.54 24.45,21.27 24.45,19.68 24.13,19.37 20.64,19.37 20.32,19.05 20.32,18.73 19.89,18.3 IC4.55
SYS_SHDN
  Top 0.254: IC3.3 27.62,46.03 26.99,46.67 R10.2 25.72,46.77 25.72,49.53 24.77,50.48 R5.2
UART2RX  (via drill 0.4)
  Top 0.254: IC4.17 7.04,22.8 6.99,22.86 6.99,25.4 6.35,26.04 6.35,30.48 8.89,33.02 10.79,33.02 v11.11,33.34 | R4.2 v20.95,51.75 R12.2
  Bottom 0.254: v20.95,51.75 19.68,50.48 19.68,48.9 18.41,47.62 12.38,47.62 11.11,46.35 v11.11,33.34
UART2TX  (via drill 0.4)
  Top 0.254: IC4.16 9.59,25.34 9.53,25.4 7.94,25.4 6.99,26.35 6.99,30.16 9.21,32.38 11.43,32.38 v12.38,33.34 | R3.2 v22.86,51.75
  Bottom 0.254: v22.86,51.75 22.23,51.75 20.32,49.85 20.32,48.58 18.73,46.99 12.7,46.99 11.75,46.04 11.75,33.97 v12.38,33.34
VCAM  (via drill 0.4)
  Top 0.254: CAM1.21 22.03,6.16 22.54,6.67 C21.1 22.56,6.99 v23.5,6.99 | CAM1.14 18.53,6.87 v18.1,7.3 C22.1
  Top 0.61: IC5.5 32.06,12.16 C20.1 32.07,11.96 v32.07,10.79
  Bottom 0.61: v18.1,7.3 18.41,6.99 v23.5,6.99 28.26,6.99 v32.07,10.79
VCC  (via drill 0.4)
  Top 0.254: IC2.5 6.04,39.69 6.03,39.69 4.45,39.69 | 4.45,39.69 C10.1 | v4.45,40.32 4.45,39.69 | C18.1 v6.35,14.29 6.35,14.61 7.04,15.3 IC4.32 | IC4.1 17.09,24.19 18.48,22.8 IC4.64 20.58,22.8 v20.64,22.86 C16.1 | IC4.48 17.09,12.76 17.14,12.7 18.73,12.7 18.84,12.8 C17.1 18.84,13.44 19.37,13.97 23.81,13.97 25.72,15.88 v25.72,16.19 | v13.65,29.84 R27.2 | IC4.19 5.82,21.8 v5.4,22.23 C15.1 | R16.2 25.72,32.38 25.72,33.97 R15.2 v26.67,33.97 | IC1.4 25.71,39.37 25.72,39.37 25.72,40.96 | 25.72,40.96 C1.1 | v26.67,40.64 26.35,40.96 25.72,40.96 | L3.2 8.89,29.53 v9.21,29.84 | R29.2 R30.2 v23.18,20.95
  Top 0.61: JP2.1 30.48,40.96 31.43,41.91 31.43,42.87 31.43,42.86 C9.1 31.25,43.14 IC3.5
  Bottom 0.254: 6.35,13.97 v6.35,14.29
  Bottom 0.61: v6.35,14.29 6.35,15.88 6.99,16.51 6.99,20.64 v5.4,22.23 3.49,24.13 3.49,28.89 4.45,29.84 5.71,29.84 | v25.72,16.19 25.72,18.41 v23.18,20.95 21.27,22.86 v20.64,22.86 20.64,29.84 | 26.67,40.01 JP2.1 | 20.64,29.84 v13.65,29.84 v9.21,29.84 5.71,29.84 | v26.67,40.64 26.67,40.01 | 26.67,40.01 v26.67,33.97 24.77,33.97 20.64,29.84 | v4.45,40.32 5.71,39.05 5.71,29.84
VDD  (via drill 0.4)
  Top 0.254: R26.2 9.74,46.84 C26.1
  Top 0.61: R31.1 12.06,46.38 IC6.1 | IC6.1 10.15,46.73 C26.1 | L1.2 v26.67,51.75 | IC6.1 12.12,46.73 | v13.34,46.04 13.34,46.35 12.96,46.73 IC6.1
  Bottom 0.61: v26.67,51.75 20.95,46.04 v13.34,46.04
VSYNC  (via drill 0.4)
  Top 0.254: IC4.59 17.12,20.3 v16.51,19.68 | CAM1.18 20.53,5.82 20.32,6.03 v20.32,10.48
  Bottom 0.254: v16.51,19.68 16.51,14.92 20.32,11.11 v20.32,10.48
XCLK
  Top 0.254: IC4.41 13.59,12.45 16.51,9.53 16.51,6.86 17.53,5.84 CAM1.12

### Text on the board
silk: GND | M0 | M1 | PTT | AUD | ST | RXD | TXD | EN | VDD | VCC | CLK | SW- | GND | SW- | DIO | RST | SWO | SSTV CAMERA | OK2ALP v3/2020 | OV2640